# EAGLE design FLR01A (EAGLE 6.5.0)
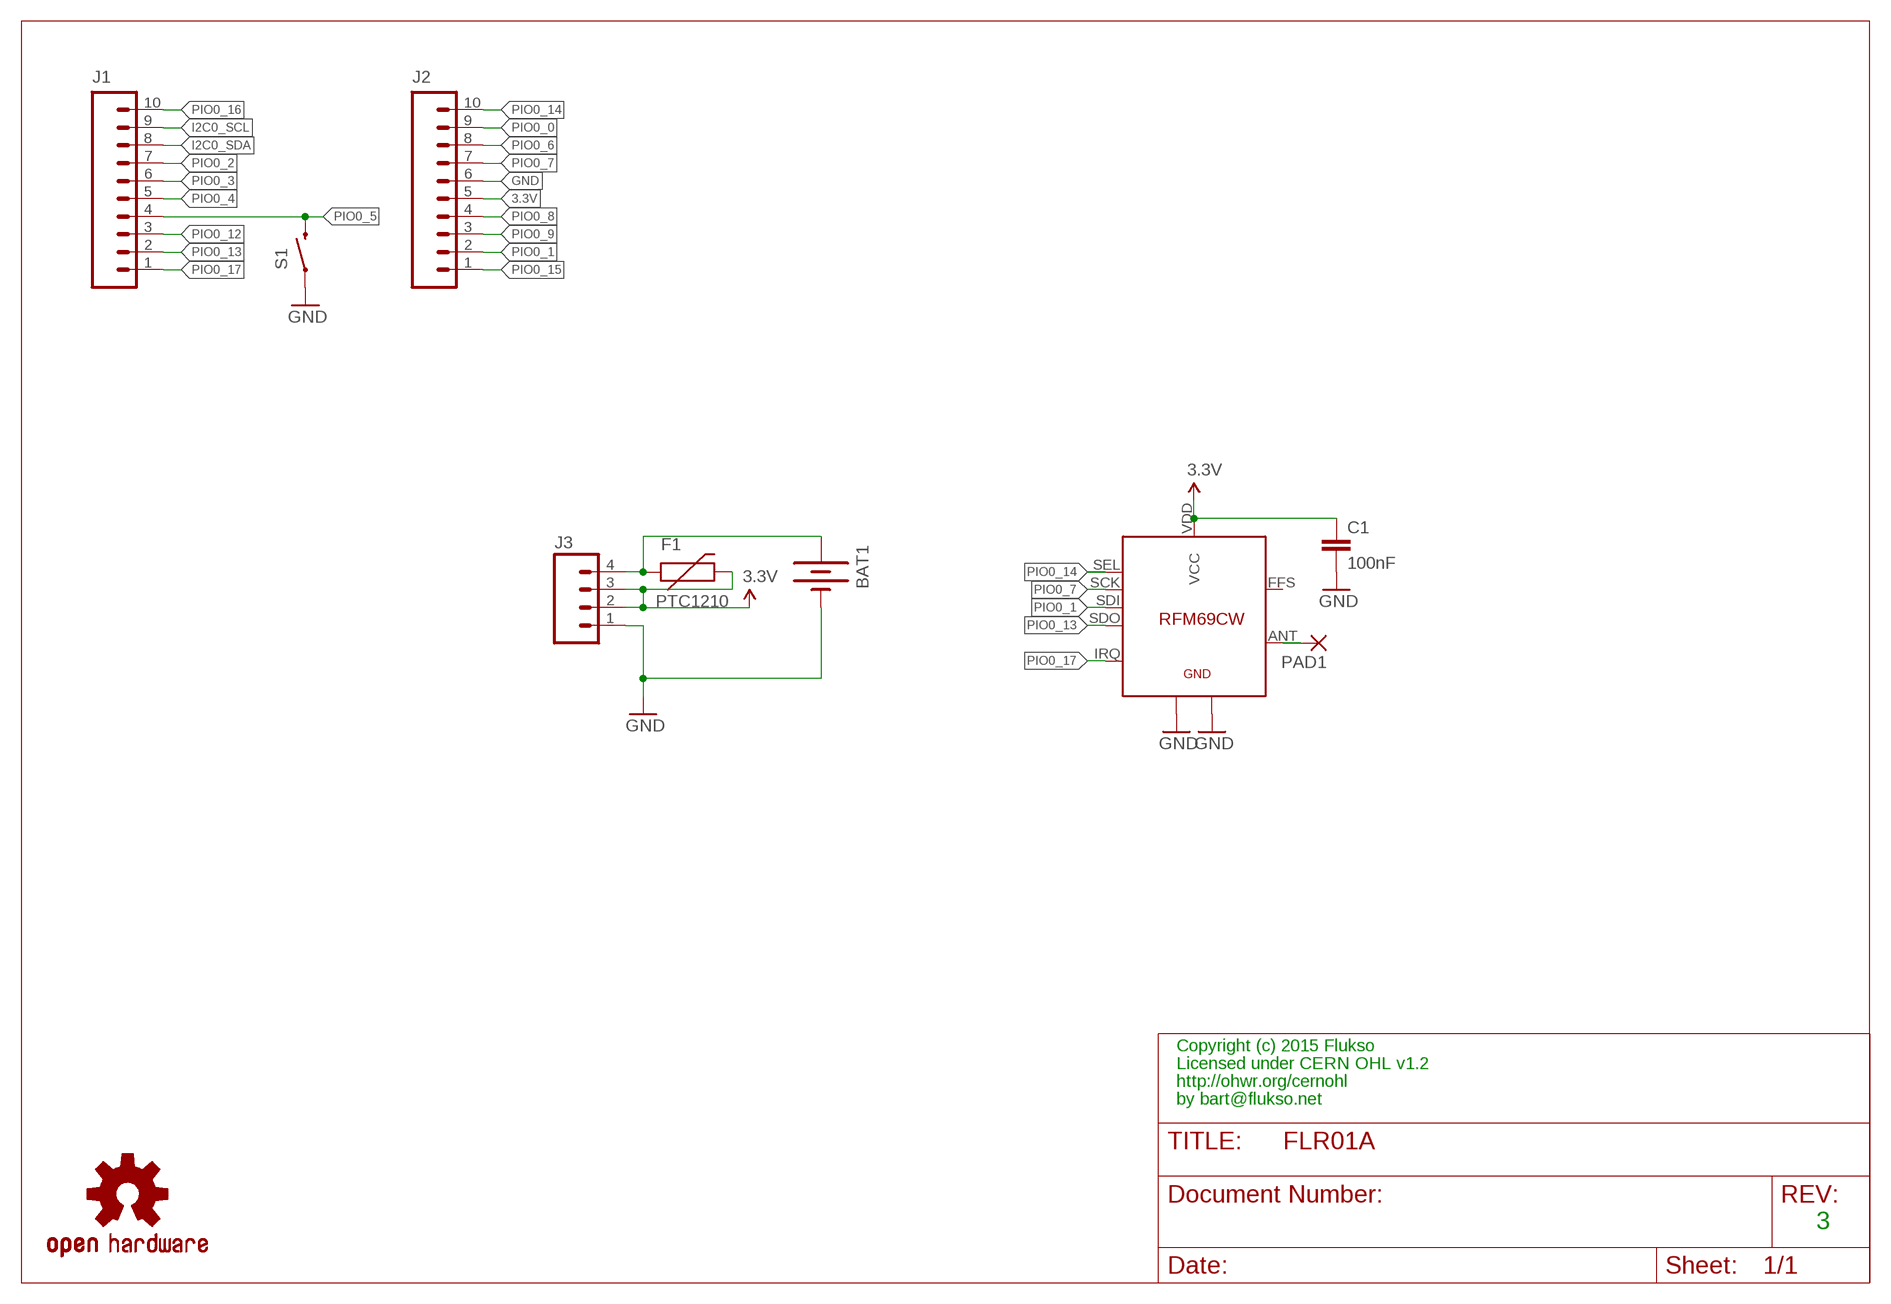
[diagram p0: schematic, sheet 1]

## Parts
BAT1  BATTERY245PTH  [BATTCON_245MM_PTH]
C1  100nF  CAP0402-CAP  [0402-CAP]
F1  PTC1210  [1210]
J1  M10SMD_FEMALE_SHORT  [1X10_SMD_FEMALE_SHORT]
J2  M10SMD_FEMALE_SHORT  [1X10_SMD_FEMALE_SHORT]
J3  M041X04_NO_SILK  [1X04_NO_SILK]
PAD1  WIREPAD_1,6/0,8  [WIREPAD_1,6/0,8]
S1  SWITCH-MOMENTARY-2SMD  [TACTILE_SWITCH_SMD]
U$1  OSHW-LOGOS  [OSHW-LOGO-S]
U$2  RFM69CW  [RFM69CW]

## Nets
3.3V: C1.1 F1.2 J2.5 J3.2 J3.3 U$2.VDD(VCC)
GND: BAT1.2(-) C1.2 J2.6 J3.1 S1.1 U$2.GND1 U$2.GND2
I2C0_SCL: J1.9
I2C0_SDA: J1.8
N$1: BAT1.3(+) F1.1 J3.4
N$6: PAD1.1(P) U$2.ANT
PIO0_0: J2.9
PIO0_1: J2.2 U$2.SDI
PIO0_2: J1.7
PIO0_3: J1.6
PIO0_4: J1.5
PIO0_5: J1.4 S1.3
PIO0_6: J2.8
PIO0_7: J2.7 U$2.SCK
PIO0_8: J2.4
PIO0_9: J2.3
PIO0_12: J1.3
PIO0_13: J1.2 U$2.SDO
PIO0_14: J2.10 U$2.SEL
PIO0_15: J2.1
PIO0_16: J1.10
PIO0_17: J1.1 U$2.IRQ
Unconnected: U$2.FFS

## Notes on the sheet
- Copyright (c) 2015 Flukso
- Licensed under CERN OHL v1.2
- http://ohwr.org/cernohl
- by bart@flukso.net
- 3

## Library data of the parts
BAT1 = SparkFun-Electromechanical:BATTERY: Battery Holders Various common sizes : AA, AAA, 20mm coin cell and 12mm coin cell. 20MM_4LEGS, BATT-10373
C1 = sparkFun:CAP: Capacitor Standard 0603 ceramic capacitor, and 0.1" leaded capacitor.
F1 = flukso:PTC: Resettable Fuse PTC Resettable Fuse. Spark Fun Electronics SKU : COM-08357
J1 J2 = flukso:M10: Header 10 Standard 10-pin 0.1" header. Use with straight break away headers (SKU : PRT-00116), right angle break away headers (PRT-00553), swiss pins (PRT-00743), machine pins (PRT-00117), and female headers (PRT-00115).
J3 = SparkFun-Connectors:M04: Header 4 Standard 4-pin 0.1" header. Use with straight break away headers (SKU : PRT-00116), right angle break away headers (PRT-00553), swiss pins (PRT-00743), machine pins (PRT-00117), and female headers (PRT-00115). Molex polarized connector foot print use with SKU : PRT-08231 with associated crimp pins and housings. 1MM SMD Version SKU: PRT-10208
PAD1 = flukso:WIREPAD_1,6/0,8: THROUGH-HOLE PAD
S1 = SparkFun-Electromechanical:SWITCH-MOMENTARY-2: Various NO switches- pushbuttons, reed, etc; PROD_ID: SWCH-08247
U$1 = sparkFun:OSHW-LOGO: Open Source Hardware Logo This logo indicates the piece of hardware it is found on incorporates a OSHW license and/or adheres to the definition of open source hardware found here: http://freedomdefined.org/OSHW
U$2 = flukso:RFM69CW

## Net classes
0 default: width 0.2 mm
1 power: width 0.305 mm

## Board
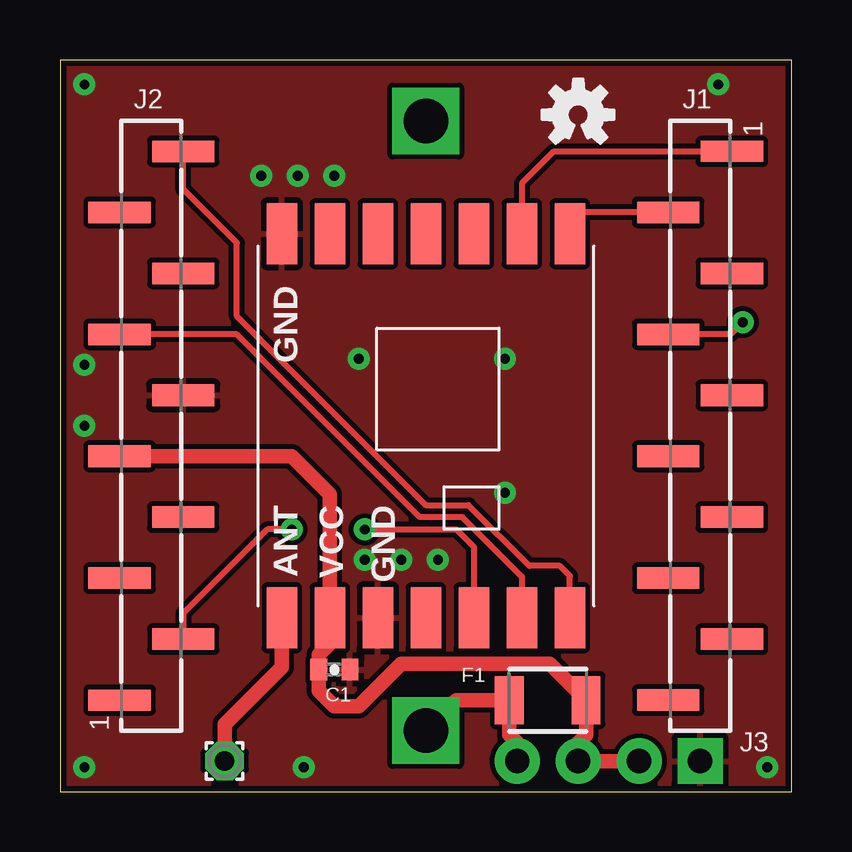
[diagram p1: board, top side]
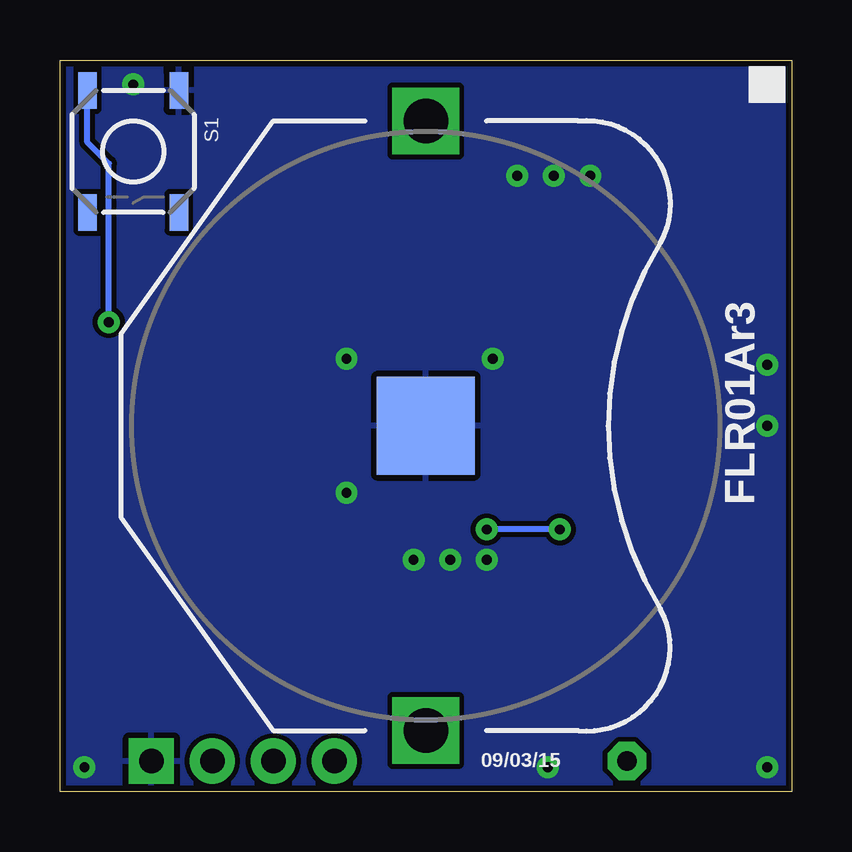
[diagram p2: board, bottom side, seen from below]

Size 30.48 x 30.48 mm. Coordinates in mm from the lower left corner, seen from the top.
Outline: 0,0 30.48,0 30.48,30.48 0,30.48 0,0
Copper layers (1*16): Top 0.035mm / dielectric 1.5mm / Bottom 0.035mm
Design rules "sparkfun": minimum track width 8mil, minimum drill 16mil, track to track 8mil, track to pad 8mil, pad to pad 8mil, via to via 8mil, smd to smd 8mil, copper to edge 10mil, drill to drill 8mil, minimum pad ring 12mil, minimum via ring 10mil, stop-mask expansion 4mil, vias tented up to drill 25mil, thermal gap 10mil

### Footprints (pad centres in the part's own frame; a part is rotated, then mirrored left to right if it is on the bottom)
BATTCON_245MM_PTH = drill 1.854 square: 1 -12.7,0; 3 12.7,0 | smd 4.064 x 4.064: 2 0,0
0402-CAP = smd 0.7 x 0.9: 1 -0.65,0; 2 0.65,0
1210 = smd 1.2 x 2: 1 -1.6,0; 2 1.6,0
1X10_SMD_FEMALE_SHORT = smd 0.876 x 2.601: 1 0,1.326 | smd 0.899 x 2.601: 2 2.54,-1.326; 3 5.08,1.326; 4 7.62,-1.326; 5 10.16,1.326; 6 12.7,-1.326; 7 15.24,1.326; 8 17.78,-1.326; 9 20.32,1.326; 10 22.86,-1.326
1X04_NO_SILK = drill 1.016 pad 1.88 square: 1 0,0 | drill 1.016 pad 1.88: 2 2.54,0; 3 5.08,0; 4 7.62,0
WIREPAD_1,6/0,8 = drill 0.813 pad 1.6 octagon: 1 0,0
TACTILE_SWITCH_SMD = smd 1.524 x 0.762: 1 -2.54,1.905; 2 2.54,1.905; 3 -2.54,-1.905; 4 2.54,-1.905
RFM69CW = smd 2.54 x 1.27: ANT 8,-6; FFS -8,2; GND1 8,-2; GND2 -8,-6; IRQ -8,4; P$8 -8,0; P$9 -8,-2; P$10 -8,-4; P$16 8,0; SCK 8,4; SDI 8,2; SDO -8,6; SEL 8,6; VDD 8,-4

### Placement (x,y rotation side)
BAT1  15.24,15.24 270 bottom
C1  11.43,5.08 0 top
F1  20.32,3.81 0 top
J1  26.67,26.67 270 top
J2  3.81,3.81 90 top
J3  26.67,1.27 180 top
PAD1  6.86,1.27 0 top
S1  27.43,26.67 270 bottom
U$1  21.59,28.19 0 top
U$2  15.24,15.24 270 top

### Tracks (layer width: path | path; a pad name or v marks a point on that pad's centre or on a via)
3.3V
  Top 0.61: J3.2 J3.3 21.59,2.03 21.92,2.36 F1.2 20.4,5.33 14.22,5.33 12.45,3.56 11.43,3.56 10.78,4.21 C1.1 10.78,5.7 11.24,6.16 U$2.VDD 11.24,12.38 9.65,13.97 J2.5
GND  (via drill 0.41 pad 0.61)
  other vias: 12.7,9.65 14.22,9.65 8.38,25.65 9.91,25.65 12.45,18.03 18.54,18.03 18.54,12.45 27.43,29.46 1.02,29.46 1.02,1.02 29.46,1.02 10.16,1.02 11.43,25.65 15.75,9.65 1.02,17.78 1.02,15.24
  pour Bottom: 0,0 0,30.48 30.48,30.48 30.48,0
  pour Top: 0,0 0,30.48 30.48,30.48 30.48,0
N$1
  Top 0.61: BAT1.3 16.51,3.81 F1.1 18.72,2.36 19.05,2.03 J3.4
N$6
  Top 0.61: PAD1.1 6.86,2.79 9.24,5.18 U$2.ANT
PIO0_1  (via drill 0.41 pad 0.61)
  Top 0.254: v12.7,10.92 16.51,10.92 17.24,10.19 U$2.SDI | v9.65,10.92 8.64,10.92 5.14,7.42 J2.2
  Bottom 0.254: v9.65,10.92 v12.7,10.92
PIO0_5  (via drill 0.41 pad 0.61)
  Top 0.254: v28.45,19.56 27.94,19.05 J1.4
  Bottom 0.254: v28.45,19.56 28.45,26.16 29.34,27.05 S1.3
PIO0_7
  Top 0.254: J2.7 7.37,19.05 14.99,11.43 16.76,11.43 19.24,8.95 U$2.SCK
PIO0_13
  Top 0.254: J1.2 21.24,24.13 U$2.SDO
PIO0_14
  Top 0.254: J2.10 5.14,25.09 7.37,22.86 7.37,19.81 15.24,11.94 17.02,11.94 19.56,9.4 20.83,9.4 21.24,8.99 21.24,7.11 21.08,7.11 21.08,7.24 U$2.SEL
PIO0_17
  Top 0.254: J1.1 20.57,26.67 19.24,25.34 U$2.IRQ

### Text on the board
bPlace: FLR01Ar3 | 09/03/15